# Altium schematic sheet SHDN-BSPD-S11-V00-Buzzer.SchDoc
size A3
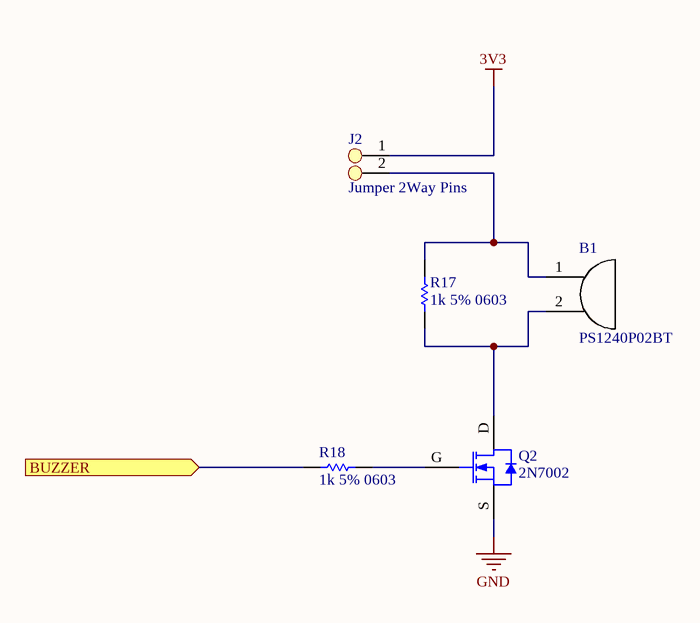
[diagram p0: SHDN-BSPD-S11-V00-Buzzer.SchDoc]

## Parts
B1  PS1240P02BT  [PS1240P02BT]
J2  Jumper 2Way Pins  [Jumper_2Way_Pin]
Q2  2N7002  [SOT23-3]
R17  1k 5% 0603  [Res_ThinFilm_0603]
R18  1k 5% 0603  [Res_ThinFilm_0603]

## Ports
BUZZER (in)

## Nets
3V3: J2.1
GND: Q2.S
BUZZER: R18.2 ; port BUZZER
NetB1_1: B1.1 J2.2 R17.2
NetB1_2: B1.2 Q2.D R17.1
NetQ2_G: Q2.G R18.1

## Notes on the sheet
- Title
- Size:
- Date:
- A3
- Number:
- Time:
- Revision:
- Sheet
- of
- File:

## Library data of the parts
B1 = PS1240P02BT: Buzzers Transducer, Externally Driven Piezo 3V 4kHz 60dB @ 3V, 10cm Through Hole PC Pins
J2 = Jumper 2Way Side Pins
R17 R18 = 1k 5% 0603: Resistor, SMD, 1k, 0.1W, 5%, 0603